# EAGLE design nRF52 Sensor Platform v1 (EAGLE 9.5.0)
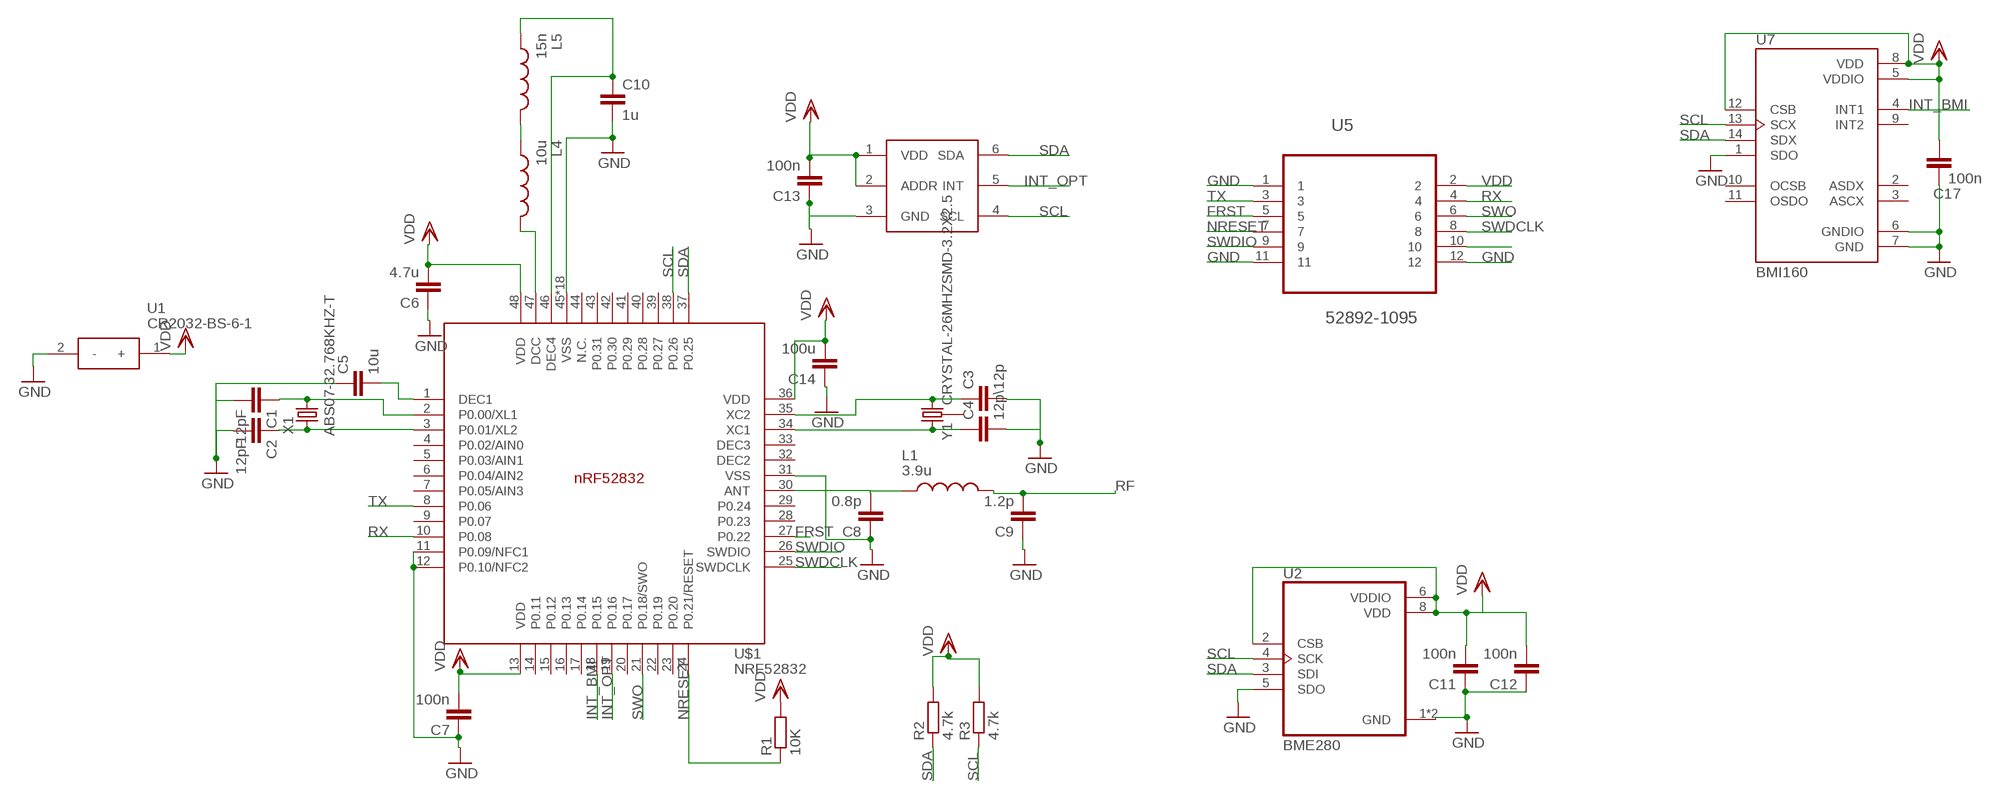
[diagram p0: schematic, sheet 1]

## Parts
C1  12pF  CC0402  [C0402]
C2  12pF  CC0402  [C0402]
C3  12p  CC0402  [C0402]
C4  12p\  CC0402  [C0402]
C5  10u  CC0402  [C0402]
C6  4.7u  CC0402  [C0402]
C7  100n  CC0402  [C0402]
C8  0.8p  CC0402  [C0402]
C9  1.2p  CC0402  [C0402]
C10  1u  CC0402  [C0402]
C11  100n  CC0402  [C0402]
C12  100n  CC0402  [C0402]
C13  100n  CC0402  [C0402]
C14  100u  CC0402  [C0402]
C17  100n  CC0402  [C0402]
L1  3.9u  MHQ0402P7N5JT000  [INDC0402X26N]
L4  10u  MHQ0402P7N5JT000  [INDC0402X26N]
L5  15n  MHQ0402P7N5JT000  [INDC0402X26N]
R1  10K  RR0402  [R0402]
R2  4.7k  RR0402  [R0402]
R3  4.7k  RR0402  [R0402]
U1  CR2032-BS-6-1  [CR2032BS61]
U2  BME280  [PSON65P250X250X100-8N]
U5  52892-1095  [MOLEX_52892-1095]
U7  BMI160  [PQFN50P300X250X88-14N]
U$1  NRF52832  [QFN40P600X600X90-48_N]
U$2  TI-OPT3001  [TI-OPT3001]
X1  ABS07-32.768KHZ-T  [ABS07-32.768KHZ-T]
Y1  CRYSTAL-26MHZSMD-3.2X2.5  [CRYSTAL-SMD-3.2X2.5MM]

## Nets
FRST: U5.5 U$1.27(P0.22)
GND: C1.2 C2.2 C3.2 C4.2 C5.1 C6.1 C7.1 C8.1 C9.1 C10.2 C11.1 C12.1 C13.1 C14.1 C17.2 U1.2(-) U2.1(GND) U2.5(SDO) U2.7(GND) U5.1 U5.11 U5.12 U7.1(SDO) U7.6(GNDIO) U7.7(GND) U$1.11(P0.09/NFC1) U$1.12(P0.10/NFC2) U$1.31(VSS) U$1.45(VSS) U$1.PAD(VSS) U$1.PAD@VIA01(VSS) U$1.PAD@VIA02(VSS) U$1.PAD@VIA03(VSS) U$1.PAD@VIA04(VSS) U$1.PAD@VIA05(VSS) U$1.PAD@VIA06(VSS) U$1.PAD@VIA07(VSS) U$1.PAD@VIA08(VSS) U$1.PAD@VIA09(VSS) U$1.PAD@VIA10(VSS) U$1.PAD@VIA11(VSS) U$1.PAD@VIA12(VSS) U$1.PAD@VIA13(VSS) U$1.PAD@VIA14(VSS) U$1.PAD@VIA15(VSS) U$1.PAD@VIA16(VSS) U$2.3(GND)
INT_BMI: U7.4(INT1) U$1.18(P0.15)
INT_OPT: U$1.19(P0.16) U$2.5(INT)
N$1: C1.1 U$1.2(P0.00/XL1) X1.2
N$2: C2.1 U$1.3(P0.01/XL2) X1.1
N$3: C3.1 U$1.35(XC2) Y1.3
N$4: C4.1 U$1.34(XC1) Y1.1
N$5: C5.2 U$1.1(DEC1)
N$6: C8.2 L1.1 U$1.30(ANT)
N$9: L4.2 U$1.47(DCC)
N$10: L4.1 L5.2
N$11: C10.1 L5.1 U$1.46(DEC4)
N$21: U5.10
NRESET: R1.1 U5.7 U$1.24(P0.21/RESET)
RF: C9.2 L1.2
RX: U5.4 U$1.10(P0.08)
SCL: R3.1 U2.4(SCK) U7.13(SCX) U$1.38(P0.26) U$2.4(SCL)
SDA: R2.1 U2.3(SDI) U7.14(SDX) U$1.37(P0.25) U$2.6(SDA)
SWDCLK: U5.8 U$1.25(SWDCLK)
SWDIO: U5.9 U$1.26(SWDIO)
SWO: U5.6 U$1.21(P0.18/SWO)
TX: U5.3 U$1.8(P0.06)
VDD: C6.2 C7.2 C11.2 C12.2 C13.2 C14.2 C17.1 R1.2 R2.2 R3.2 U1.1(+) U2.2(CSB) U2.6(VDDIO) U2.8(VDD) U5.2 U7.5(VDDIO) U7.8(VDD) U7.12(CSB) U$1.13(VDD) U$1.36(VDD) U$1.48(VDD) U$2.1(VDD) U$2.2(ADDR)
Unconnected: U7.2(ASDX) U7.3(ASCX) U7.9(INT2) U7.10(OCSB) U7.11(OSDO) U$1.4(P0.02/AIN0) U$1.5(P0.03/AIN1) U$1.6(P0.04/AIN2) U$1.7(P0.05/AIN3) U$1.9(P0.07) U$1.14(P0.11) U$1.15(P0.12) U$1.16(P0.13) U$1.17(P0.14) U$1.20(P0.17) U$1.22(P0.19) U$1.23(P0.20) U$1.28(P0.23) U$1.29(P0.24) U$1.32(DEC2) U$1.33(DEC3) U$1.39(P0.27) U$1.40(P0.28) U$1.41(P0.29) U$1.42(P0.30) U$1.43(P0.31) U$1.44(N.C.) Y1.2 Y1.4

## Library data of the parts
C1-C14 C17 = eagle-ltspice:C: CAPACITOR, European symbol; SPICEMODEL: NONE; SPICEPREFIX: C
L1 L4 L5 = MHQ0402P7N5JT000:MHQ0402P7N5JT000: 221 NH 5% GOLD TERMINAL; AVAILABILITY: Unavailable; DESCRIPTION: FIXED IND 7.5NH 200MA 1.2 OHM; MF: TDK; MP: MHQ0402P7N5JT000; PACKAGE: 0402 TDK; PRICE: None
R1-R3 = eagle-ltspice:R: RESISTOR, European symbol; SPICEMODEL: NONE; SPICEPREFIX: R
U1 = CR2032-BS-6-1:CR2032-BS-6-1: Battery Holders, Clips & Contacts SMD RoHS Source: Datasheet <https://datasheet.lcsc.com/szlcsc/Q-J-CR2032-BS-6-1_C70377.pdf>; DESCRIPTION: Battery Holders, Clips & Contacts SMD RoHS; HEIGHT: 6mm; MANUFACTURER_NAME: Q&J; MANUFACTURER_PART_NUMBER: CR2032-BS-6-1
U2 = BME280:BME280: DIGITAL HUMIDITY, PRESSURE AND TEMPERATURE SENSOR * Digital interface I²C (up to 3.4 MHz) and SPI (3 and 4 wire, up to 10 MHz)* Supply voltage VDD main supply voltage range: 1.71 V to 3.6 V*VDDIO interface voltage range: 1.2 V to 3.6 V Operating range -40…+85 °C, 0…100 % rel. humidity, 300…1100 hPa The library has been designed by Richard Magdycz <https://www.facebook.com/groups/eaglecadsoftUK>; AVAILABILITY: Unavailable; DESCRIPTION: Integrated pressure, humidity and temperature sensor; 8-pin 2.5x2.5x0.93mm LGA; MF: Bosch; MP: BME280; PACKAGE: LGA-8 Bosch; PRICE: None
U5 = 52892-1095:52892-1095: CONNECTOR, FPC, ZIF, 0.50MM, 10 WAY; AVAILABILITY: Unavailable; DESCRIPTION: Socket, r/a, Fpc, Zif, Smt, 10way; MF: Molex; MP: 52892-1095; PACKAGE: None; PRICE: None
U7 = BMI160:BMI160: BMI160 2.5 x 3 mm Tiaxial Accelerometer / Gyroscope Inertial Measurement Unit; AVAILABILITY: Unavailable; DESCRIPTION: BMI160 2.5 x 3 mm Tiaxial Accelerometer / Gyroscope Inertial Measurement Unit; MF: Bosch; MP: BMI160; PACKAGE: LGA-14 Bosch; PRICE: None
U$1 = Nordic_nRF:NRF52832: nRF52832 Features Single chip, highly flexible, 2.4 GHz multi-protocol SoC 32-bit ARM Cortex-M4F Processor 1.7v to 3.6v operation 512kB flash + 64kB RAM Supports concurrent Bluetooth Smart/ANT protocol operation On-chip NFC tag for Out-of-Band (OOB) pairing Up to +4dBm output power -96dBm sensitivity, Bluetooth Smart Thread safe and run-time protected Event driven API On air compatible with nRF24L and nRF24AP series 2 data rates (2Mbps/1Mbps) PPI - maximum flexibility for power-efficient applications and code simplification Automated power management system with automatic power management of each peripheral Configurable I/O mapping for analog and digital I/O 3 x Master/Slave SPI 2 x Two-wire interface (I²C) UART (RTS/CTS) 3 x PWM AES HW encryption Real Time Counter (RTC) Digital microphone interface (PDM) On-chip balun Applications Internet of Things (IoT) Wearables SmartHome sensors Connected white goods Computer peripherals Voice-command smart remotes A4WP ‘Rezence’ wireless charging Beacons Sports and fitness sensors and hubs Connected health products Smart watches RC Toys Interactive games Building automation and sensor networks
U$2 = FaBo-Mems:TI-OPT3001
X1 = Crystals:ABS07-32.768KHZ-T: CRYSTAL 32.7680KHZ 12.5PF SMD Manufacturer's datasheet <https://abracon.com/Resonators/ABS07.pdf>; CREATED_BY: PCBLayout.com; DIGIKEY_PART_NUMBER: 535-9542-2-ND; MANUFACTURER: Abracon LLC; MPN: ABS07-32.768KHZ-T; PACKAGE: SMD-2
Y1 = SparkFun-Clocks:CRYSTAL-26MHZ: 26MHz Crystal w/ Ground Pin Digikey Example <http://www.digikey.com/product-detail/en/epson/TSX-3225%2026.0000MF09Z-AC3/SER3627CT-ND/1802878> Frequency: 26MHz Frequency Stability: ±9ppm Frequency Tolerance: ±10ppm Load Capacitance: 9pF SparkFun Products: SparkFun ESP32 Thing <https://www.sparkfun.com/products/13907> SparkFun ESP8266 Thing Dev Board <https://www.sparkfun.com/products/13711>; PROD_ID: XTAL-12454

## Board
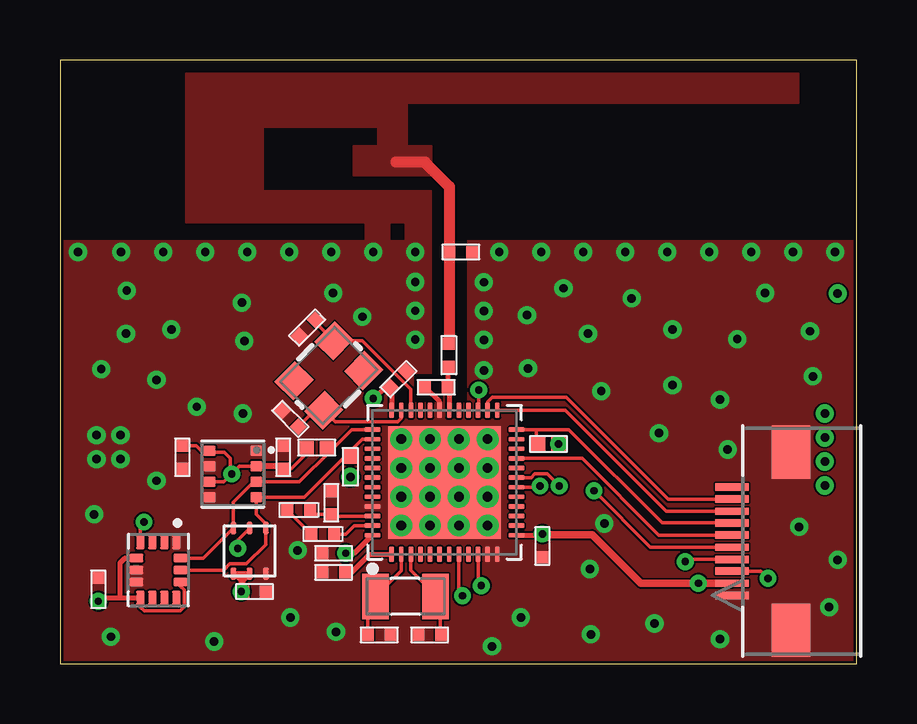
[diagram p1: board, top side]
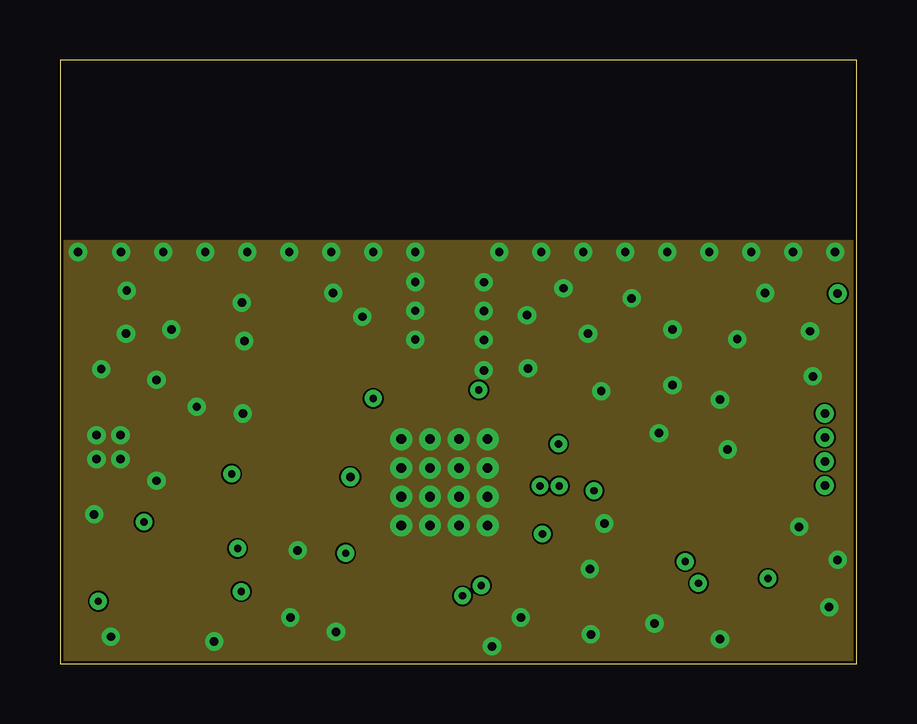
[diagram p2: board, inner layer Route2]
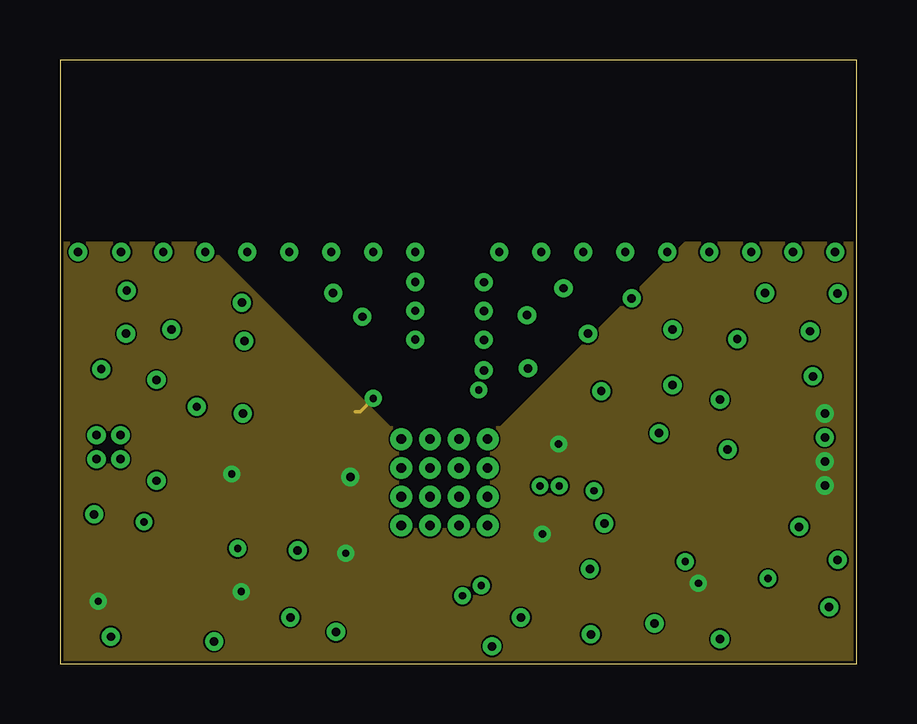
[diagram p3: board, inner layer Route15]
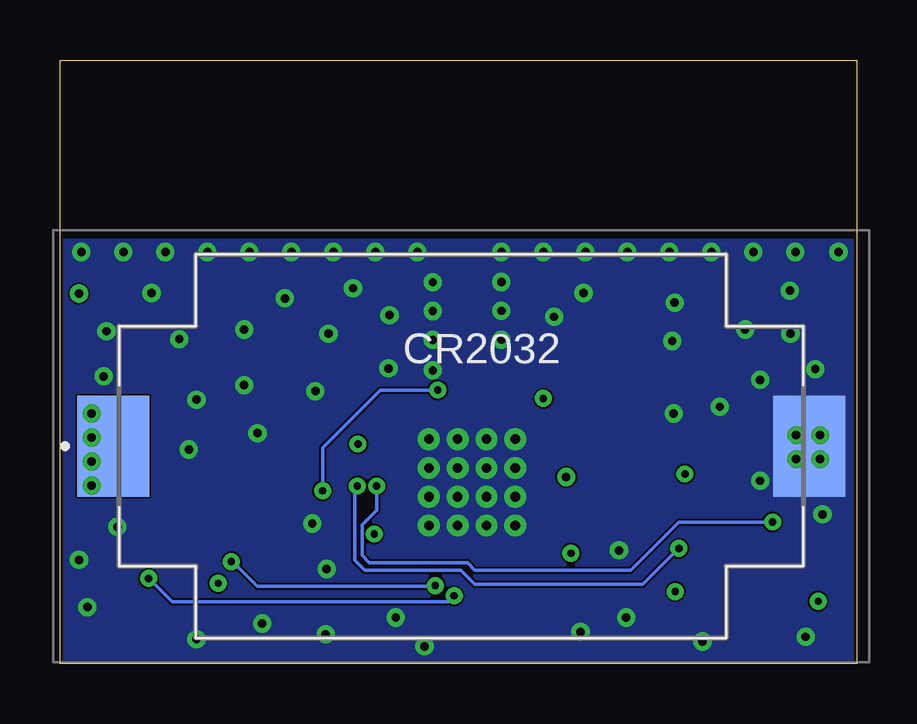
[diagram p4: board, bottom side, seen from below]

Size 33.19 x 25.15 mm. Coordinates in mm from the lower left corner, seen from the top.
Outline: 0,0 33.19,0 33.19,25.15 0,25.15 0,0
Copper layers (1+2*15+16): Top 0.035mm / dielectric 0.2mm / Route2 0.0175mm / dielectric 0.465mm / Route15 0.0175mm / dielectric 0.2mm / Bottom 0.035mm
Design rules "default *": minimum track width 4mil, minimum drill 0.3mm, track to track 3mil, track to pad 3mil, pad to pad 3mil, via to via 3mil, smd to smd 6mil, copper to edge 5mil, drill to drill 4mil, minimum pad ring 10mil, minimum via ring 8mil, stop-mask expansion 0mil, vias tented up to drill 40mil, thermal gap 0mil
tRestrict: area 15.5,12.1 to 15.9,17.7; area 16.5,12.6 to 17,17.7; area 16.4,10.9 to 16.9,12.6; area 14.8,10.9 to 15.9,12.1; 1 lines

### Footprints (pad centres in the part's own frame; a part is rotated, then mirrored left to right if it is on the bottom)
C0402 = smd 0.5 x 0.5: 1 -0.475,0; 2 0.475,0
INDC0402X26N = smd 0.5 x 0.5: 1 -0.732,0; 2 0.232,0
R0402 = smd 0.6 x 0.55: 1 -0.425,0; 2 0.425,0
CR2032BS61 = smd 4.2 x 3: 1 0,14.5; 2 0,-14.5
PSON65P250X250X100-8N = smd 0.49 x 0.45: 1 0.97,0.975; 2 0.97,0.325; 3 0.97,-0.325; 4 0.97,-0.975; 5 -0.97,-0.975; 6 -0.97,-0.325; 7 -0.97,0.325; 8 -0.97,0.975
MOLEX_52892-1095 = smd 0.305 x 1.397: 1 2.261,2.896; 2 1.753,2.896; 3 1.245,2.896; 4 0.762,2.896; 5 0.254,2.896; 6 -0.254,2.896; 7 -0.762,2.896; 8 -1.245,2.896; 9 -1.753,2.896; 10 -2.261,2.896 | smd 2.21 x 1.6: 11 -3.702,5.359; 12 3.702,5.359
PQFN50P300X250X88-14N = smd 0.59 x 0.35: 1 -1.165,0.75; 2 -1.165,0.25; 3 -1.165,-0.25; 4 -1.165,-0.75; 8 1.165,-0.75; 9 1.165,-0.25; 10 1.165,0.25; 11 1.165,0.75 | smd 0.35 x 0.59: 5 -0.5,-0.915; 6 0,-0.915; 7 0.5,-0.915; 12 0.5,0.915; 13 0,0.915; 14 -0.5,0.915
QFN40P600X600X90-48_N = smd 0.65 x 0.2: 1 -3,2.2; 2 -3,1.8; 3 -3,1.4; 4 -3,1; 5 -3,0.6; 6 -3,0.2; 7 -3,-0.2; 8 -3,-0.6; 9 -3,-1; 10 -3,-1.4; 11 -3,-1.8; 12 -3,-2.2; 25 3,-2.2; 26 3,-1.8; 27 3,-1.4; 28 3,-1; 29 3,-0.6; 30 3,-0.2; 31 3,0.2; 32 3,0.6; 33 3,1; 34 3,1.4; 35 3,1.8; 36 3,2.2 | smd 0.2 x 0.65: 13 -2.2,-3; 14 -1.8,-3; 15 -1.4,-3; 16 -1,-3; 17 -0.6,-3; 18 -0.2,-3; 19 0.2,-3; 20 0.6,-3; 21 1,-3; 22 1.4,-3; 23 1.8,-3; 24 2.2,-3; 37 2.2,3; 38 1.8,3; 39 1.4,3; 40 1,3; 41 0.6,3; 42 0.2,3; 43 -0.2,3; 44 -0.6,3; 45 -1,3; 46 -1.4,3; 47 -1.8,3; 48 -2.2,3 | smd 4.7 x 4.7: PAD 0,0 | drill 0.4: PAD@VIA01 -1.8,1.8; PAD@VIA02 -1.8,0.6; PAD@VIA03 -1.8,-0.6; PAD@VIA04 -1.8,-1.8; PAD@VIA05 -0.6,1.8; PAD@VIA06 -0.6,0.6; PAD@VIA07 -0.6,-0.6; PAD@VIA08 -0.6,-1.8; PAD@VIA09 0.6,1.8; PAD@VIA10 0.6,0.6; PAD@VIA11 0.6,-0.6; PAD@VIA12 0.6,-1.8; PAD@VIA13 1.8,1.8; PAD@VIA14 1.8,0.6; PAD@VIA15 1.8,-0.6; PAD@VIA16 1.8,-1.8
TI-OPT3001 = smd 0.5 x 0.25: 1 -0.95,0.675; 2 -0.95,0; 3 -0.95,-0.675; 4 0.95,-0.675; 5 0.95,0; 6 0.95,0.675
ABS07-32.768KHZ-T = smd 1.1 x 1.9: 1 -1.25,0; 2 1.25,0
CRYSTAL-SMD-3.2X2.5MM = smd 1.2 x 1.1: 1 -1.175,-0.875; 2 1.175,-0.875; 3 1.175,0.875; 4 -1.175,0.875

### Placement (x,y rotation side)
C1  13.3,1.2 0 top
C2  15.4,1.2 180 top
C3  9.6,10.2 135 top
C4  10.3,14 225 top
C5  11.4,3.8 0 top
C6  20.1,4.9 90 top
C7  11.4,4.6 0 top
C8  15.68,11.52 0 top
C9  16.7,17.15 180 top
C10  11.3,6.7 90 top
C11  8.1,3 180 top
C12  5.1,8.6 90 top
C13  9.3,8.6 270 top
C14  14.1,11.85 225 top
C17  1.6,3.1 90 top
L1  16.2,13.1 90 top
L4  11.2,5.4 0 top
L5  9.7,6.4 180 top
R1  20.35,9.15 0 top
R2  10.7,9 180 top
R3  12.1,8.2 270 top
U1  16.48,9.06 90 bottom
U2  7.2,7.9 0 top
U5  25.1,5.1 270 top
U7  4.1,3.9 270 top
U$1  16.02,7.55 90 top
U$2  7.9,4.7 90 top
X1  14.4,2.8 180 top
Y1  11.2,12 225 top

### Tracks (layer width: path | path; a pad name or v marks a point on that pad's centre or on a via)
FRST  (via drill 0.3)
  Top 0.15: U5.5 24.6,4.85 v22.25,7.2 | v17.45,11.4 17.45,10.58 U$1.27
  Bottom 0.15: v22.25,7.2 22.25,9 19.85,11.4 v17.45,11.4
GND  (via drill 0.35)
  Top 0.2: U$1.31 15.82,10.9 C8.1
  other vias: 0.75,17.15 2.55,17.15 4.3,17.15 6.05,17.15 7.8,17.15 9.55,17.15 11.3,17.15 13.05,17.15 14.8,17.15 32.3,17.15 30.55,17.15 28.8,17.15 27.05,17.15 25.3,17.15 23.55,17.15 21.8,17.15 20.05,17.15 18.3,17.15 4.64,13.92 2.75,13.75 7.68,13.44 5.7,10.7 1.72,12.27 9.6,1.92 19.2,1.92 24.77,1.67 30.8,5.7 27.5,11 24.96,9.6 31.37,11.97 25.52,11.6 22.55,11.35 31.25,13.85 25.52,13.92 22,13.75 19.46,14.52 12.6,14.45 19.5,12.3 32.05,2.35 2.52,8.52 1.52,8.52 2.52,9.52 1.52,9.52 17.66,14.69 17.66,15.89 17.66,13.49 14.8,13.5 14.8,14.7 14.8,15.9 7.62,10.42 4.02,11.82 4.02,7.62 1.42,6.22 6.42,0.92 2.12,1.12 22.12,1.22 27.82,8.92 28.22,13.52 23.82,15.22 29.38,15.44 20.98,15.64 11.38,15.44 7.58,15.04 2.78,15.54 22.68,5.84 22.08,3.94 17.66,12.22 9.9,4.72 11.5,1.32 18,0.72 27.5,1.02 32.4,4.32
  pour Top: -0.1,17.6 33.3,17.6 33.3,0 -0.1,0
  pour Bottom: 0,17.6 33.3,17.6 33.3,0.1 0,0.1
  pour Route2: -0.15,17.6 33.1,17.6 33.1,0 -0.15,0
GND5  (via drill 0.35)
  other vias: 32.4,15.42
GND6  (via drill 0.35)
  other vias: 31.87,9.42
INT_BMI  (via drill 0.3)
  Top 0.15: U7.4 3.35,5.75 v3.5,5.9 | v20,7.4 19.95,7.35 U$1.18
  Bottom 0.15: v3.5,5.9 7.4,5.9 9.4,3.9 15.9,3.9 16.2,4.2 20.3,4.2 20.6,4.5 20.6,5.8 20,6.4 v20,7.4
INT_OPT  (via drill 0.3)
  Top 0.15: U$2.5 7.4,5.15 v7.4,4.8 | v20.8,7.4 20.3,7.9 19.79,7.9 19.64,7.75 U$1.19
  Bottom 0.15: v7.4,4.8 8.9,3.3 15.9,3.3 16.5,3.9 20.5,3.9 20.9,4.3 20.9,7.3 v20.8,7.4
N$1
  Top 0.15: U$1.2 14.22,3.87 X1.2 12.82,2.48 C1.1
N$2
  Top 0.15: U$1.3 14.62,3.88 15.65,2.85 X1.1 15.85,2.6 15.85,1.23 C2.1
N$3
  Top 0.15: U$1.35 14.22,10.23 14.06,10.07 11.46,10.07 Y1.3 10.62,10.55 C3.1
N$4
  Top 0.15: U$1.34 14.62,11.43 12.6,13.45 Y1.1 10.64,14.23 C4.1
N$5
  Top 0.2: C5.2 12.15,3.8 12.9,4.55 U$1.1
N$6
  Top 0.2: L1.1 16.16,12.32 C8.2 16.22,11.45 U$1.30
N$9
  Top 0.15: U$1.47 12.25,5.75 11.9,5.4 L4.2
N$10
  Top 0.15: L4.1 L5.2
N$11
  Top 0.15: U$1.46 11.38,6.15 C10.1 10.61,6.22 L5.1
NRESET
  Top 0.15: U5.7 25.09,5.86 21.2,9.75 19.85,9.75 | 19.85,9.75 U$1.24 | R1.1 19.85,9.22 19.85,9.75
RF
  Top 0.46: 14,20.9 15.2,20.9 16.23,19.88 C9.2 16.23,13.36 L1.2
  pour Top: 5.27,18.4 5.27,24.57 30.75,24.57 30.75,23.36 14.45,23.36 14.45,21.56 15.46,21.56 15.46,20.35 12.24,20.35 12.24,21.55 13.25,21.55 13.25,22.36 8.45,22.36 8.45,19.69 15.45,19.69 15.45,17.66 14.41,17.66 14.41,18.4 13.72,18.4 13.72,17.66 12.73,17.66 12.73,18.4
RX  (via drill 0.3)
  Top 0.15: U$1.10 17.42,3.38 v17.55,3.25 | v26.05,4.25 26.14,4.34 U5.4
  Bottom 0.15: v17.55,3.25 17.57,3.23 24.98,3.23 26,4.25 v26.05,4.25
SCL
  Top 0.15: U$1.38 12.6,9.35 11.97,8.72 | 11.97,8.72 10.18,6.92 U2.4 8.17,6.23 8.57,5.83 U$2.4 8.57,4.96 7.76,4.15 7.07,4.15 6.82,3.9 U7.13 | R3.1 12.07,8.62 11.97,8.72
SDA
  Top 0.15: U$1.37 12.15,9.75 11.25,8.85 | 11.25,8.85 9.97,7.58 U2.3 8.07,7.58 7.22,6.73 U$2.6 5.97,4.4 U7.14 | R2.1 11.25,8.88 11.25,8.85
SWDCLK
  Top 0.15: U$1.25 21.05,10.55 25.25,6.34 U5.8
SWDIO
  Top 0.15: U5.9 25.35,6.85 21.1,11.1 18,11.1 17.82,10.92 U$1.26
SWO
  Top 0.15: U5.6 24.95,5.35 21.75,8.55 U$1.21
TX  (via drill 0.3)
  Top 0.15: v29.5,3.55 29.2,3.85 U5.3 | U$1.8 16.62,2.97 v16.77,2.82
  Bottom 0.15: v16.77,2.82 17.02,2.57 28.52,2.57 v29.5,3.55
VDD  (via drill 0.3, 0.35)
  Top 0.15: C12.2 5.67,9.07 5.88,8.88 U2.8 6.3,8.8 6.85,8.8 7.1,8.55 7.1,7.85 | v20.1,5.4 C6.2 20.07,5.35 | U7.8 3.35,2.35 3.5,2.2 5,2.2 5.18,2.38 5.18,3.07 5.01,3.23 U7.12 | U2.2 7.47,8.22 v7.15,7.9 7.1,7.85 | 7.1,7.85 6.83,7.58 U2.6 | C17.1 v1.6,2.6
  Top 0.152: C13.2 9.62,8.12 10.28,8.78 R2.2
  Top 0.2: U$1.36 13.81,11.46 C14.2 13.56,11.51 13.1,11.05 v13.05,11.05 | U$1.48 12.27,4.6 v11.9,4.6 C7.2 | U$1.13 20.07,5.35 22.2,5.35 24.2,3.35 | C11.2 7.62,3.4 | 7.62,3.4 7.62,3.48 U$2.2 7.55,3.75 | 7.55,3.75 U$2.1 7.28,3.75 7.62,3.4 | v7.55,3 7.55,3.75 | C17.1 1.71,2.73 2.5,2.73 | 2.5,2.73 U7.8 | 2.5,2.73 2.5,4.2 2.7,4.4 U7.5 | C13.2 9.2,8.22
  Top 0.254: 9.2,8.22 U2.2
  Top 0.305: C6.2 22.18,5.38 24.2,3.35 U5.2
  Route15 0.15: v13.05,11.05 12.5,10.5 12.3,10.5 | v12.1,7.78 12.1,7.8
  Bottom 0.15: U1.1 31.23,9.06 v31.87,8.42
  other vias: 31.87,7.42 31.87,10.42 20.77,9.15 26.6,3.35
  pour Route15: 18.4,9.8 26.1,17.5 33.5,17.5 33.5,0 0,0 0,17.5 6,17.5 13.7,9.8

### Text on the board
bPlace: CR2032